# Altium schematic sheet JN5168.SchDoc
size A4; Date: 1/11/2016; Engineer: JBayalas; DocumentNumber: 4; Revision: V1.1; SheetNumber: 4; SheetTotal: 13
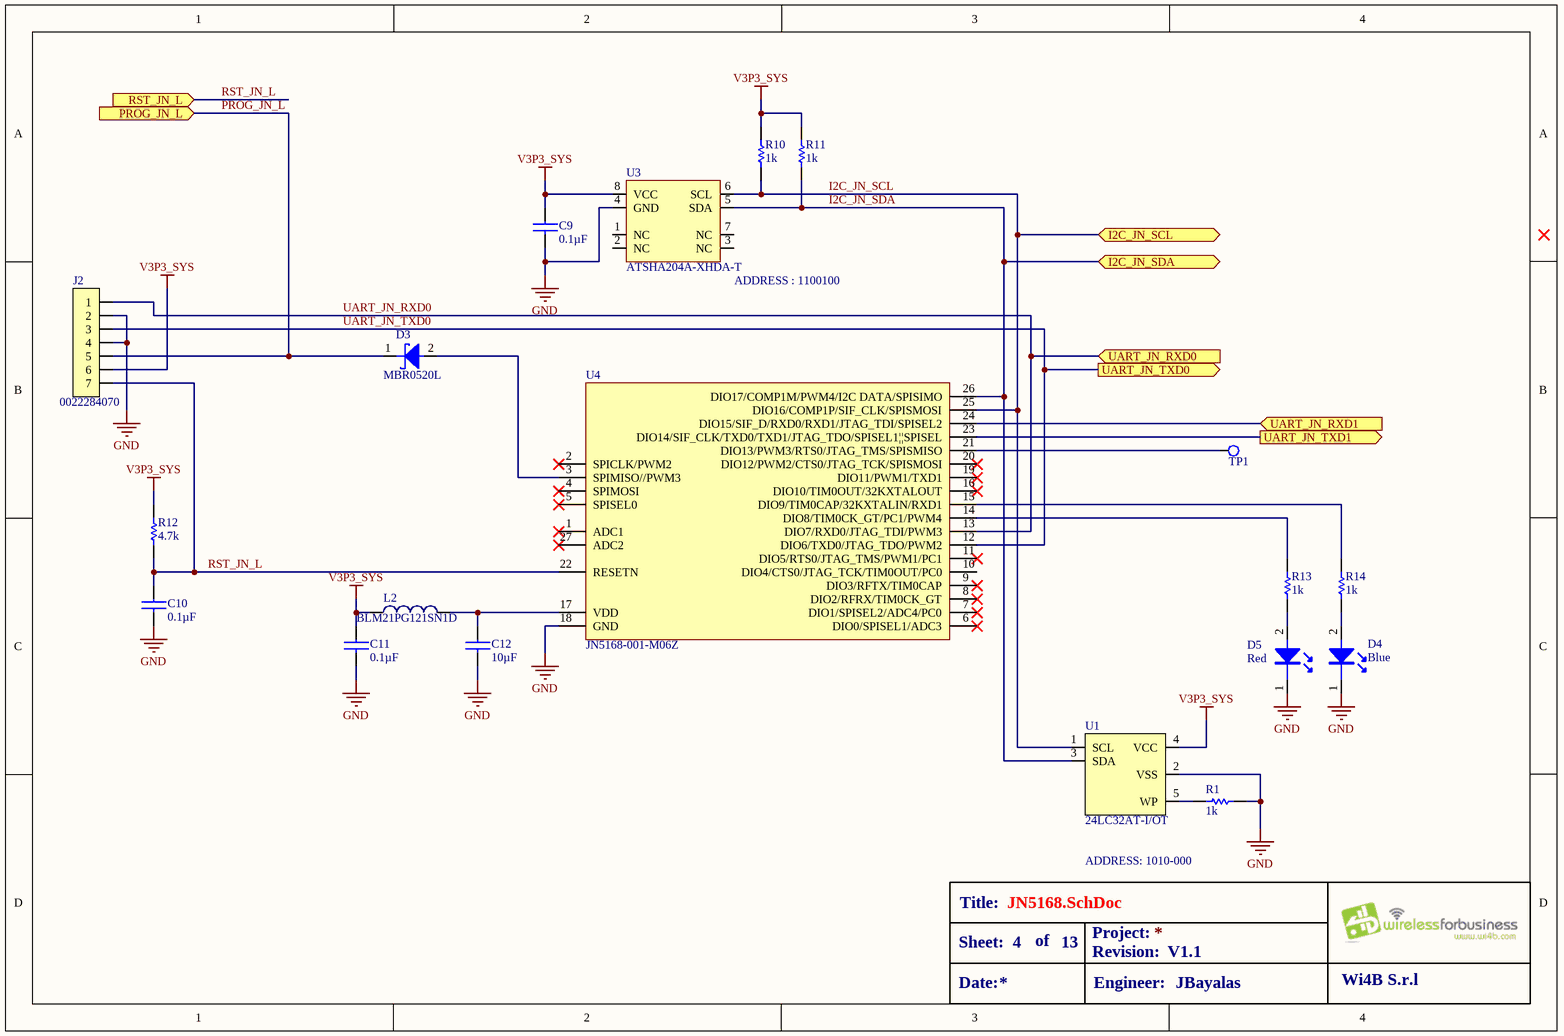
[diagram p0: JN5168.SchDoc]

## Parts
C9  value 0.1µF  [C0402]  (hidden comment: *)
C10  value 0.1µF  [C0402]  (hidden comment: *)
C11  value 0.1µF  [C0402]  (hidden comment: *)
C12  value 10µF  [C0805]  (hidden comment: *)
D3  MBR0520L  [SOD123]
D4  value Blue  [LED-0603 (BLUE)]  (hidden comment: *)
D5  value Red  [LED0805 - (RED)]  (hidden comment: *)
J2  *  [0022284070]  (value not drawn)
L2  *  [0805 INDUCTOR]  (value not drawn)
R1  value 1k  [R0402]  (hidden comment: *)
R10  value 1k  [R0402]  (hidden comment: *)
R11  value 1k  [R0402]  (hidden comment: *)
R12  value 4.7k  [R0603]  (hidden comment: *)
R13  value 1k  [R0603]  (hidden comment: *)
R14  value 1k  [R0603]  (hidden comment: *)
TP1  *  [Test Point 1.27mm]  (value not drawn)
U1  *  [SOT-23-5]  (value not drawn)
U3  ATSHA204A-XHDA-T  [TSSOP-8 (wide Body)]
U4  JN5168-001-M06Z  [JN5168-001-M06Z]

## Ports
I2C_JN_SCL (bidir), I2C_JN_SDA (bidir), PROG_JN_L (in), RST_JN_L (in), UART_JN_RXD0 (in), UART_JN_RXD1 (in), UART_JN_TXD0 (out), UART_JN_TXD1 (out)

## Nets
GND: C9.2 C10.2 C11.2 C12.2 D4.1 D5.1 J2.2 J2.4 R1.2 U1.2(VSS) U3.4(GND) U4.18(GND)
V3P3_SYS: C9.1 C11.1 J2.6 L2.2 R10.2 R11.2 R12.2 U1.4(VCC) U3.8(VCC)
I2C_JN_SCL: R10.1 U1.1(SCL) U3.6(SCL) U4.25(DIO16/COMP1P/SIF_CLK/SPISMOSI) ; port I2C_JN_SCL
I2C_JN_SDA: R11.1 U1.3(SDA) U3.5(SDA) U4.26(DIO17/COMP1M/PWM4/I2C_DATA/SPISIMO) ; port I2C_JN_SDA
PROG_JN_L: D3.1(cathode) J2.5 ; port PROG_JN_L
RST_JN_L: C10.1 J2.7 R12.1 U4.22(RESETN) ; port RST_JN_L
UART_JN_RXD0: J2.1 U4.13(DIO7/RXD0/JTAG_TDI/PWM3) ; port UART_JN_RXD0
UART_JN_RXD1: U4.24(DIO15/SIF_D/RXD0/RXD1/JTAG_TDI/SPISEL2) ; port UART_JN_RXD1
UART_JN_TXD0: J2.3 U4.12(DIO6/TXD0/JTAG_TDO/PWM2) ; port UART_JN_TXD0
UART_JN_TXD1: U4.23(DIO14/SIF_CLK/TXD0/TXD1/JTAG_TDO/SPISEL1||SPISEL) ; port UART_JN_TXD1
NetC12_1: C12.1 L2.1 U4.17(VDD)
NetD3_2: D3.2(anode) U4.3(SPIMISO//PWM3)
NetD4_2: D4.2 R14.2
NetD5_2: D5.2 R13.2
NetR1_1: R1.1 U1.5(WP)
NetR13_1: R13.1 U4.14(DIO8/TIM0CK_GT/PC1/PWM4)
NetR14_1: R14.1 U4.15(DIO9/TIM0CAP/32KXTALIN/RXD1)
NetTP1_1: TP1.1 U4.21(DIO13/PWM3/RTS0/JTAG_TMS/SPISMISO)

Not connected (* = marked no-connect by the designer): U3 1(NC) 2(NC) 3(NC) 7(NC); U4 1(ADC1)* 2(SPICLK/PWM2)* 4(SPIMOSI)* 5(SPISEL0)* 6(DIO0/SPISEL1/ADC3)* 7(DIO1/SPISEL2/ADC4/PC0)* 8(DIO2/RFRX/TIM0CK_GT)* 9(DIO3/RFTX/TIM0CAP)* 10(DIO4/CTS0/JTAG_TCK/TIM0OUT/PC0) 11(DIO5/RTS0/JTAG_TMS/PWM1/PC1)* 16(DIO10/TIM0OUT/32KXTALOUT)* 19(DIO11/PWM1/TXD1)* 20(DIO12/PWM2/CTS0/JTAG_TCK/SPISMOSI)* 27(ADC2)*

## Notes on the sheet
- (near U3) ADDRESS : 1100100
- ADDRESS: 1010-000
- Title:
- Sheet:
- Date:
- of
- Project:
- Revision:
- Engineer:
- Wi4B S.r.l

## Library data of the parts
C9-C11 = CL05B104KO3LNNC: CAP CER 0.1UF 16V X7R 0402; MFT: Samsung Electro-Mechanics America, Inc.; RATING: ±10%, 16V; TYPE: Surface Mount, MLCC; FUNCTION: JENNIC; MPN: CL05B104KO3LNNC
C12 = GRM219R60J106KE19D: CAP CER 10UF 6.3V X5R 0805; MFT: Murata Electronics North America; TYPE: Surface Mount, MLCC; FUNCTION: JENNIC; MPN: GRM219R60J106KE19D; RATING: 6.3V
D3 = MBR0520L: DIODE SCHOTTKY 20V 0.5A SOD123; MFT: ON Semiconductor; TYPE: SMD; RATING: 20V 500MA; FUNCTION: JENNIC; VALUE: MBR0520L; MPN: MBR0520L
D4 = LTST-C191TBKT: LED BLUE CLEAR 0603 SMD; MFT: Lite-On Inc.; TYPE: Surface Mount; FUNCTION: JENNIC; MPN: LTST-C191TBKT
D5 = LS R976-NR-1: LED CHIPLED 633NM RED 0805 SMD; MFT: OSRAM Opto Semiconductors Inc.; FUNCTION: JENNIC; MPN: LS R976-NR-1
J2 = 0022284070: CONN HEADER 7POS .100 VERT TIN; MFT: Molex, LLC; FUNCTION: JENNIC; VALUE: 0022284070; TYPE: TH; RATING: *; LOAD: *; MPN: 0022284070
L2 = BLM21PG121SN1D: FERRITE CHIP 120 OHM 0805; MFT: Murata Electronics North America; RATING: 3A; TYPE: Surface Mount; VALUE: 120 Ohm; FUNCTION: JENNIC; MPN: BLM21PG121SN1D
R1 R10 R11 = MCS04020C1001FE000: RES SMD 1K OHM 1% 1/10W 0402; MFT: Vishay Beyschlag; FUNCTION: JENNIC; MPN: MCS04020C1001FE000; TYPE: SMD; RATING: 1/10W; LOAD: *
R12 = ERA-3AEB472V: RES SMD 4.7K OHM 0.1% 1/10W 0603; MFT: Panasonic; FUNCTION: JENNIC; MPN: ERA-3AEB472V; LOAD: *; RATING: 1/10W; TYPE: SMD
R13 R14 = ERJ-3EKF1001V: RES SMD 1K OHM 1% 1/10W 0603; MFT: Panasonic Electronic Components; RATING: 0.1W; FUNCTION: JENNIC; MPN: ERJ-3EKF1001V; TYPE: Surface Mount
TP1 = Test Point: Test Point 1.27mm; FUNCTION: JENNIC
U1 = 24LC32AT-I/OT: IC EEPROM 32KBIT 400KHZ SOT23-5; MFT: Microchip Technology; FUNCTION: JENNIC; VALUE: 24LC32AT-I/OT; TYPE: SMD; RATING: *; LOAD: *; MPN: 24LC32AT-I/OT
U3 = ATSHA204A-XHDA-T: IC CRYPTO 4.5KB I2C; MFT: Microchip Technology; FUNCTION: JENNIC; LOAD: *; TYPE: SMD; VALUE: ATSHA204A-XHDA-T; RATING: *; MPN: ATSHA204A-XHDA-T
U4 = JN5168-001-M06Z: RF TXRX MODULE 802.15.4 U.FL ANT; MFT: NXP USA Inc.; FUNCTION: JENNIC; VALUE: JN5168-001-M06Z; TYPE: SMD; RATING: *; LOAD: *; MPN: JN5168-001-M06Z